# Altium schematic sheet Battery Monitoring.SchDoc
size A4; Author1: Russell MacGregor; VersionControl_Repository: BatteryMonitorSpring2025; Organization: Machine Intellgence Laboratory; Des1: This IC monitors the voltage; Des2: of the battery and the current; Des3: drawn from it.; SheetNumber: 2; SheetTotal: 4
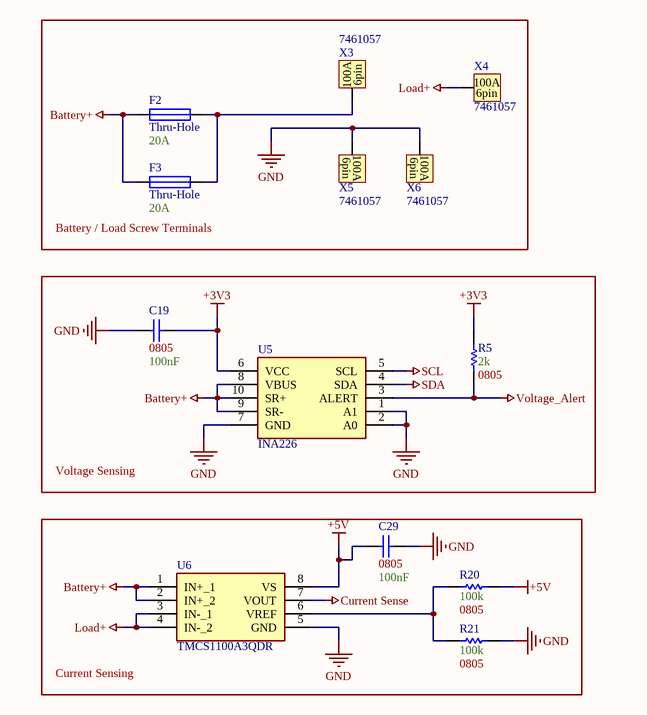
[diagram p0: Battery Monitoring.SchDoc]

## Parts
C19  Size Package: 0805  Capacitance: 100nF  [[Cap] SMD 0805]  (hidden comment: [Cap] SMD Nonpolarized)
C29  Size Package: 0805  Capacitance: 100nF  [[Cap] SMD 0805]  (hidden comment: [Cap] SMD Nonpolarized)
F2  Thru-Hole  Capacity: 20A  [[Fuse] Blade (2)]
F3  Thru-Hole  Capacity: 20A  [[Fuse] Blade (2)]
R5  Resistance: 2k  Size Package: 0805  [[Res] SMD 0805]  (hidden comment: [Res] SMD Resistor)
R20  Resistance: 100k  Size Package: 0805  [[Res] SMD 0805]  (hidden comment: [Res] SMD Resistor)
R21  Resistance: 100k  Size Package: 0805  [[Res] SMD 0805]  (hidden comment: [Res] SMD Resistor)
U5  INA226  [[IC] Battery Voltage Monitor (36V)]
U6  TMCS1100A3QDR  [[IC] Hall Effect Current Sensor]
X3  7461057  [[Port] Shank Connector (100A)]
X4  7461057  [[Port] Shank Connector (100A)]
X5  7461057  [[Port] Shank Connector (100A)]
X6  7461057  [[Port] Shank Connector (100A)]

## Blocks framed on the sheet
Battery / Load Screw Terminals: F2 F3 X3-X6
Voltage Sensing: C19 R5 U5
Current Sensing: C29 R20 R21 U6

## Nets
+3V3: C19.1 R5.2 U5.6(VCC)
+5V: C29.2 R20.2 U6.8(VS)
Battery+: F2.1 F3.1 U5.8(VBUS) U5.9(SR-) U5.10(SR+) U6.1(IN+_1) U6.2(IN+_2)
Current Sense: U6.7(VOUT)
GND: C19.2 C29.1 R21.1 U5.1(A1) U5.2(A0) U5.7(GND) U6.5(GND) X5.1 X6.1
Load+: U6.3(IN-_1) U6.4(IN-_2) X4.1
SCL: U5.5(SCL)
SDA: U5.4(SDA)
Voltage_Alert: R5.1 U5.3(ALERT)
NetF2_2: F2.2 F3.2 X3.1
NetR20_1: R20.1 R21.2 U6.6(VREF)

## Notes on the sheet
- Project/Vehicle:
- Author(s):
- -
- Revisor(s):
- Git Repo:
- Git Hash:
- Date:
- Revision:
- Size:
- A4
- File:
- Sheet
- of
- (in symbol [Port] Shank Connector (100A)) 100A; 6pin

## Library data of the parts
F2 F3 = [Fuse] Thru-Hole Blade: Mouser Part #: *
U5 = [IC] Battery Voltage Monitor (36V): INA226AIDGST
U6 = [IC] Hall Effect Current Sensor: TMCS1100
X3-X6 = [Port] Shank Connector (100A): 7461057, internal thread
C19 C29 = [Cap] SMD Nonpolarized: JLC Part #: *; Mouser Part #: *